# EAGLE design Main (EAGLE 7.2.0)
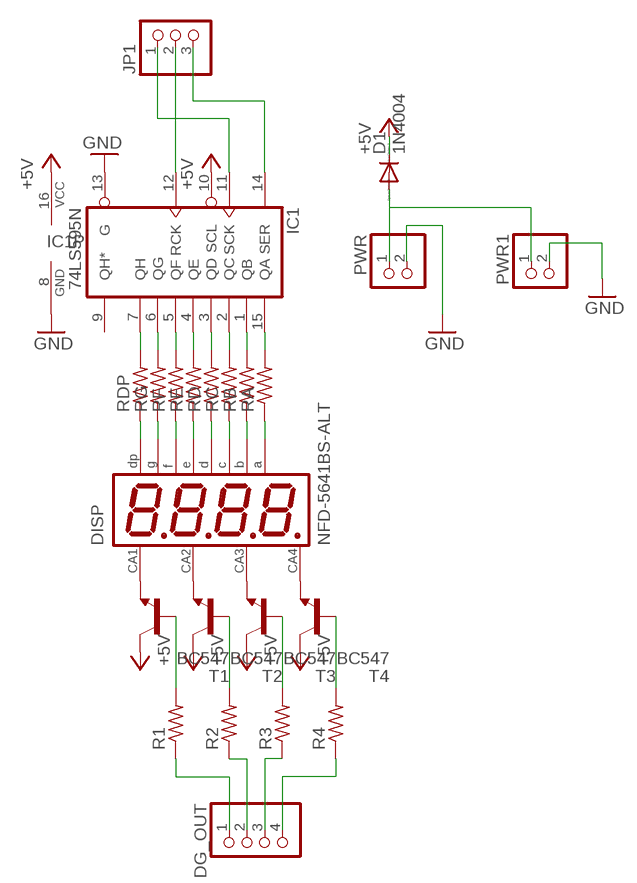
[diagram p0: schematic, sheet 1]

## Parts
D1  1N4004  [DO41-10]
DG_OUT  PINHD-1X4  [1X04]
DISP  NFD-5641BS-ALT  [NFD-5641]
IC1  74LS595N  [DIL16]
JP1  PINHD-1X3  [1X03]
PWR  PINHD-1X2  [1X02]
PWR1  PINHD-1X2  [1X02]
R1  R-US_0309/12  [0309/12]
R2  R-US_0309/12  [0309/12]
R3  R-US_0309/12  [0309/12]
R4  R-US_0309/12  [0309/12]
RA  R-US_0309/12  [0309/12]
RB  R-US_0309/12  [0309/12]
RC  R-US_0309/12  [0309/12]
RD  R-US_0309/12  [0309/12]
RDP  R-US_0309/12  [0309/12]
RE  R-US_0309/12  [0309/12]
RF  R-US_0309/12  [0309/12]
RG  R-US_0309/12  [0309/12]
T1  BC547  [TO92]
T2  BC547  [TO92]
T3  BC547  [TO92]
T4  BC547  [TO92]

## Nets
+5V: D1.C IC1.10(SCL) IC1.16(VCC) T1.3(C) T2.3(C) T3.3(C) T4.3(C)
GND: IC1.8(GND) IC1.13(G) PWR1.2 PWR.2
N$1: DISP.P$12 T1.1(E)
N$2: DISP.P$9 T2.1(E)
N$3: DISP.P$8 T3.1(E)
N$4: DISP.P$6 T4.1(E)
N$5: R1.2 T1.2(B)
N$6: R2.2 T2.2(B)
N$7: R3.2 T3.2(B)
N$8: R4.2 T4.2(B)
N$9: DG_OUT.2 R2.1
N$10: DG_OUT.3 R3.1
N$11: DG_OUT.4 R4.1
N$12: DG_OUT.1 R1.1
N$13: IC1.7(QH) RDP.2
N$14: IC1.6(QG) RG.2
N$15: IC1.5(QF) RF.2
N$16: IC1.4(QE) RE.2
N$17: IC1.3(QD) RD.2
N$18: IC1.2(QC) RC.2
N$19: IC1.1(QB) RB.2
N$20: IC1.15(QA) RA.2
N$21: IC1.11(SCK) JP1.1
N$22: IC1.12(RCK) JP1.2
N$23: IC1.14(SER) JP1.3
N$24: DISP.P$3 RDP.1
N$25: DISP.P$5 RG.1
N$26: DISP.P$10 RF.1
N$27: DISP.P$1 RE.1
N$28: DISP.P$2 RD.1
N$29: DISP.P$4 RC.1
N$30: DISP.P$7 RB.1
N$31: DISP.P$11 RA.1
N$36: D1.A PWR1.1 PWR.1
Unconnected: IC1.9(QH*)

## Library data of the parts
D1 = diode:1N4004: DIODE general purpose rectifier, 1 A
DG_OUT = pinhead:PINHD-1X4: PIN HEADER
DISP = display-4-digit-segment:NFD-5641BS-ALT: Four Digit 0.56" CA Seven-Segment LED Display Futurlec part number: 7FR5641BS Created by RobG
IC1 = 74xx-us:74*595: 8-bit SHIFT REGISTER, output latch
JP1 = pinhead:PINHD-1X3: PIN HEADER
PWR PWR1 = pinhead:PINHD-1X2: PIN HEADER
R1-R4 RA RB RC RD RDP RE RF RG = resistor:R-US_: RESISTOR, American symbol
T1-T4 = transistor:BC547: NPN TRANSISTOR

## Board
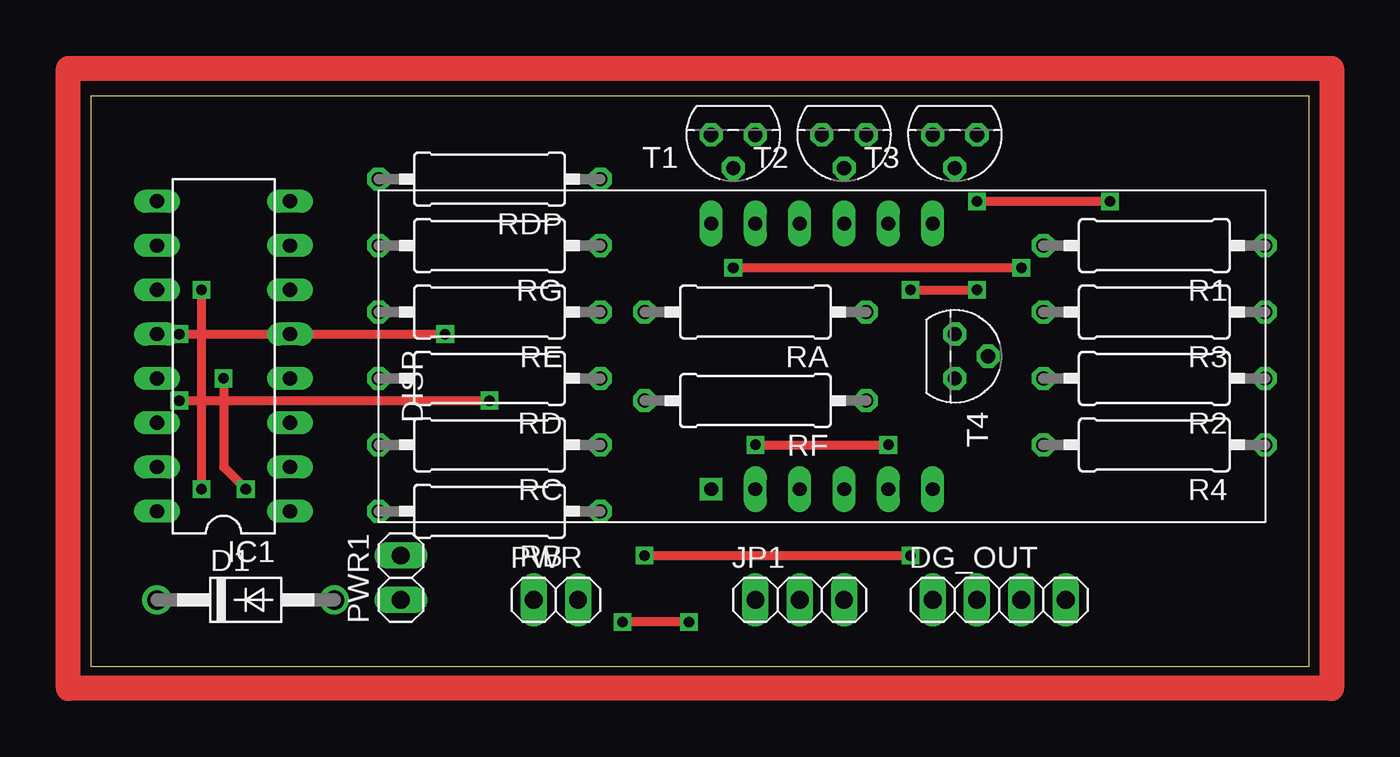
[diagram p1: board, top side]
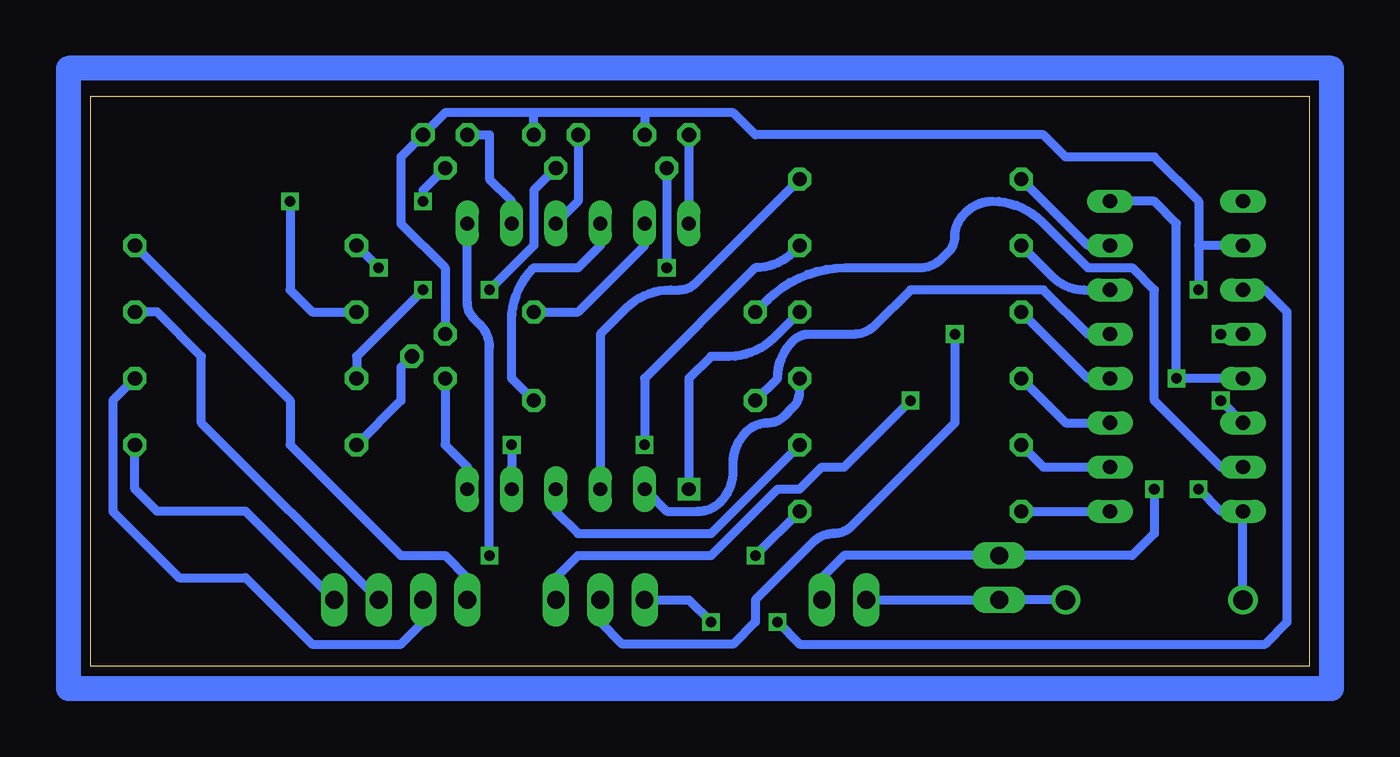
[diagram p2: board, bottom side, seen from below]

Size 69.83 x 32.69 mm. Coordinates in mm from the lower left corner, seen from the top.
Outline: 0,0 69.83,0 69.83,32.69 0,32.69 0,0
Copper layers (1*2*16): Top 0.035mm / dielectric 1.5mm / Route2 0.035mm / dielectric 0.15mm / Bottom 0.035mm
Design rules "default *": minimum track width 20mil, minimum drill 24mil, track to track 8mil, track to pad 8mil, pad to pad 8mil, via to via 8mil, smd to smd 8mil, copper to edge 40mil, drill to drill 8mil, minimum pad ring 10mil, minimum via ring 8mil, stop-mask expansion 4mil, vias tented up to drill 0mil, thermal gap 10mil

### Footprints (pad centres in the part's own frame; a part is rotated, then mirrored left to right if it is on the bottom)
DO41-10 = drill 1.118: A 5.08,0; C -5.08,0
1X04 = drill 1.016 long: 1 -3.81,0; 2 -1.27,0; 3 1.27,0; 4 3.81,0
NFD-5641 = drill 0.8 square: P$1 -6.35,-7.62 | drill 0.8 long: P$2 -3.81,-7.62; P$3 -1.27,-7.62; P$4 1.27,-7.62; P$5 3.81,-7.62; P$6 6.35,-7.62; P$7 6.35,7.62; P$8 3.81,7.62; P$9 1.27,7.62; P$10 -1.27,7.62; P$11 -3.81,7.62; P$12 -6.35,7.62
DIL16 = drill 0.813 long: 1 -8.89,-3.81; 2 -6.35,-3.81; 3 -3.81,-3.81; 4 -1.27,-3.81; 5 1.27,-3.81; 6 3.81,-3.81; 7 6.35,-3.81; 8 8.89,-3.81; 9 8.89,3.81; 10 6.35,3.81; 11 3.81,3.81; 12 1.27,3.81; 13 -1.27,3.81; 14 -3.81,3.81; 15 -6.35,3.81; 16 -8.89,3.81
1X03 = drill 1.016 long: 1 -2.54,0; 2 0,0; 3 2.54,0
1X02 = drill 1.016 long: 1 -1.27,0; 2 1.27,0
0309/12 = drill 0.813 octagon: 1 -6.35,0; 2 6.35,0
TO92 = drill 0.813 octagon: 1 1.27,0; 2 0,1.905; 3 -1.27,0

### Placement (x,y rotation side)
D1  8.89,3.81 0 top
DG_OUT  52.07,3.81 0 top
DISP  41.91,17.78 0 top
IC1  7.62,17.78 90 top
JP1  40.64,3.81 0 top
PWR  26.67,3.81 0 top
PWR1  17.78,5.08 90 top
R1  60.96,24.13 180 top
R2  60.96,16.51 180 top
R3  60.96,20.32 180 top
R4  60.96,12.7 180 top
RA  38.1,20.32 180 top
RB  22.86,8.89 180 top
RC  22.86,12.7 180 top
RD  22.86,16.51 180 top
RDP  22.86,27.94 180 top
RE  22.86,20.32 180 top
RF  38.1,15.24 180 top
RG  22.86,24.13 180 top
T1  36.83,30.48 180 top
T2  43.18,30.48 180 top
T3  49.53,30.48 180 top
T4  49.53,17.78 270 top

### Tracks (layer width: path | path; a pad name or v marks a point on that pad's centre or on a via)
+5V  (via drill 0.61)
  Top 0.508: v6.35,21.59 v6.35,10.16
  Bottom 0.508: 38.1,31.75 44.45,31.75 | T2.3 44.45,31.75 | 44.45,31.75 49.53,31.75 T3.3 52.07,29.21 52.07,25.4 49.53,22.86 T4.3 | 38.1,31.75 T1.3 | 38.1,31.75 33.02,31.75 31.75,30.48 15.24,30.48 13.97,29.21 8.89,29.21 6.35,26.67 6.35,24.13 | IC1.10 6.35,24.13 | 6.35,24.13 v6.35,21.59 | v6.35,10.16 5.08,8.89 IC1.16 D1.C
GND  (via drill 0.61)
  Top 0.508: v7.62,16.51 7.62,11.43 v8.89,10.16
  Bottom 0.508: IC1.13 v7.62,16.51 7.62,25.4 8.89,26.67 IC1.8 | v8.89,10.16 8.89,7.62 10.16,6.35 16.51,6.35 PWR1.2 26.67,6.35 27.94,5.08 PWR.2
N$1
  Bottom 0.508: T1.1 DISP.P$12
N$2
  Bottom 0.508: T2.1 41.91,26.67 DISP.P$9
N$3
  Bottom 0.508: T3.1 46.99,30.48 46.99,27.94 45.72,26.67 DISP.P$8
N$4
  Bottom 0.508: T4.1 49.53,12.7 48.26,11.43 DISP.P$6
N$5  (via drill 0.61)
  Top 0.508: v36.83,22.86 v53.34,22.86
  Bottom 0.508: T1.2 v36.83,22.86 | v53.34,22.86 R1.2
N$6  (via drill 0.61)
  Top 0.508: v46.99,21.59 v50.8,21.59
  Bottom 0.508: T2.2 44.45,27.3 44.45,24.13 v46.99,21.59 | v50.8,21.59 54.61,17.78 R2.2
N$7  (via drill 0.61)
  Top 0.508: v50.8,26.67 v58.42,26.67
  Bottom 0.508: T3.2 50.8,27.3 v50.8,26.67 | v58.42,26.67 58.42,21.59 57.15,20.32 R3.2
N$8
  Bottom 0.508: T4.2 52.07,17.14 52.07,15.24 R4.2
N$9
  Bottom 0.508: R2.1 68.58,15.24 68.58,8.89 64.77,5.08 60.96,5.08 57.15,1.27 52.07,1.27 50.8,2.54 DG_OUT.2
N$10
  Bottom 0.508: DG_OUT.3 63.5,13.97 63.5,17.78 66.04,20.32 R3.1
N$11
  Bottom 0.508: DG_OUT.4 60.96,8.89 66.04,8.89 67.31,10.16 R4.1
N$12
  Bottom 0.508: R1.1 58.42,15.24 58.42,12.7 52.07,6.35 49.53,6.35 48.26,5.08 DG_OUT.1
N$13
  Bottom 0.508: RDP.2 12.7,24.13 IC1.7
N$14
  Bottom 0.508: RG.2 14.71,22.33 arc-45 12.92,21.59 IC1.6
N$15
  Bottom 0.508: RF.2 30.48,16.51 arc45 29.58,18.68 arc45 28.68,19.05 26.14,19.05 arc-45 24.87,19.58 22.86,21.59 15.24,21.59 12.7,19.05 IC1.5
N$16
  Bottom 0.508: RE.2 12.7,16.51 IC1.4
N$17
  Bottom 0.508: RD.2 13.97,13.97 IC1.3
N$18
  Bottom 0.508: RC.2 15.24,11.43 IC1.2
N$19
  Bottom 0.508: RB.2 IC1.1
N$20
  Bottom 0.508: RA.2 31.07,21 arc45 26.58,22.86 22.33,22.86 arc-45 21.06,23.39 20.69,23.76 arc-45 20.32,24.66 arc45 19.79,25.93 19.67,26.05 arc45 18.17,26.67 arc45 15.33,25.49 12.7,22.86 10.16,22.86 8.89,21.59 8.89,15.24 5.08,11.43 IC1.15
N$21  (via drill 0.61)
  Top 0.508: v34.29,2.54 v30.48,2.54
  Bottom 0.508: JP1.1 35.56,3.81 v34.29,2.54 | v30.48,2.54 29.21,1.27 2.54,1.27 1.27,2.54 1.27,20.32 2.54,21.59 IC1.11
N$22  (via drill 0.61)
  Top 0.508: v5.08,19.05 v20.32,19.05
  Bottom 0.508: IC1.12 v5.08,19.05 | v20.32,19.05 20.32,13.97 26.3,7.99 arc45 27.2,7.62 | 27.2,7.62 | 27.2,7.62 arc-45 28.47,7.09 31.75,3.81 31.75,2.54 33.02,1.27 39.37,1.27 40.64,2.54 JP1.2
N$23  (via drill 0.61)
  Top 0.508: v5.08,15.24 v22.86,15.24
  Bottom 0.508: JP1.3 43.18,5.08 41.91,6.35 34.29,6.35 30.55,10.09 arc45 30.39,10.16 29.21,10.16 27.94,11.43 26.67,11.43 v22.86,15.24 | IC1.14 v5.08,15.24
N$24
  Bottom 0.508: DISP.P$3 40.64,19.05 39.15,20.54 arc45 36.61,21.59 36.09,21.59 arc-45 35.19,21.96 RDP.1
N$25  (via drill 0.61)
  Top 0.508: v38.1,12.7 v45.72,12.7
  Bottom 0.508: RG.1 29.58,23.76 arc45 31.75,22.86 38.1,16.51 v38.1,12.7 | 45.72,11.43 DISP.P$5 v45.72,12.7
N$26
  Bottom 0.508: RF.1 45.72,16.51 45.72,19.79 arc45 44.45,22.86 41.91,22.86 40.64,24.13 DISP.P$10
N$27
  Bottom 0.508: RE.1 30.7,18.83 arc45 33.24,17.78 34.29,17.78 35.56,16.51 DISP.P$1
N$28
  Bottom 0.508: DISP.P$2 36.83,8.89 35.03,8.89 arc-45 33.76,9.42 arc-45 33.02,11.21 33.02,11.65 arc45 32.28,13.44 arc45 31.01,13.97 arc-45 30.11,14.34 29.58,14.87 arc-45 29.21,15.77 RD.1
N$29
  Bottom 0.508: RC.1 34.29,7.62 41.91,7.62 43.18,8.89 DISP.P$4
N$30  (via drill 0.61)
  Top 0.508: v31.75,6.35 v46.99,6.35
  Bottom 0.508: RB.1 v31.75,6.35 | v46.99,6.35 46.99,18.31 arc-45 47.52,19.58 47.89,19.95 arc45 48.26,20.85 DISP.P$7
N$31
  Bottom 0.508: RA.1 41.91,20.32 38.1,24.13 DISP.P$11
N$32
  Bottom 1.422: -1.27,34.29 71.12,34.29 71.12,-1.27 -1.27,-1.27 -1.27,34.29
N$33
  Top 1.422: -1.27,34.29 71.12,34.29 71.12,-1.27 -1.27,-1.27 -1.27,34.29
N$36
  Bottom 0.508: PWR.1 PWR1.1 D1.A